# EasyEDA Pro project ProPrj_New Project_2026-07-15_23-14-34_2026-07-27.epro, schematic Schematic3
Board Name: Board1; Create Date: 2026-07-15; Page Name: P1; Project Name: New Project_2026-07-15_23-14-34; Schematic Name: Schematic1; Update Date: 2026-07-15; Company: EasyEDA.com; Page Size: A4; Version: V1.0
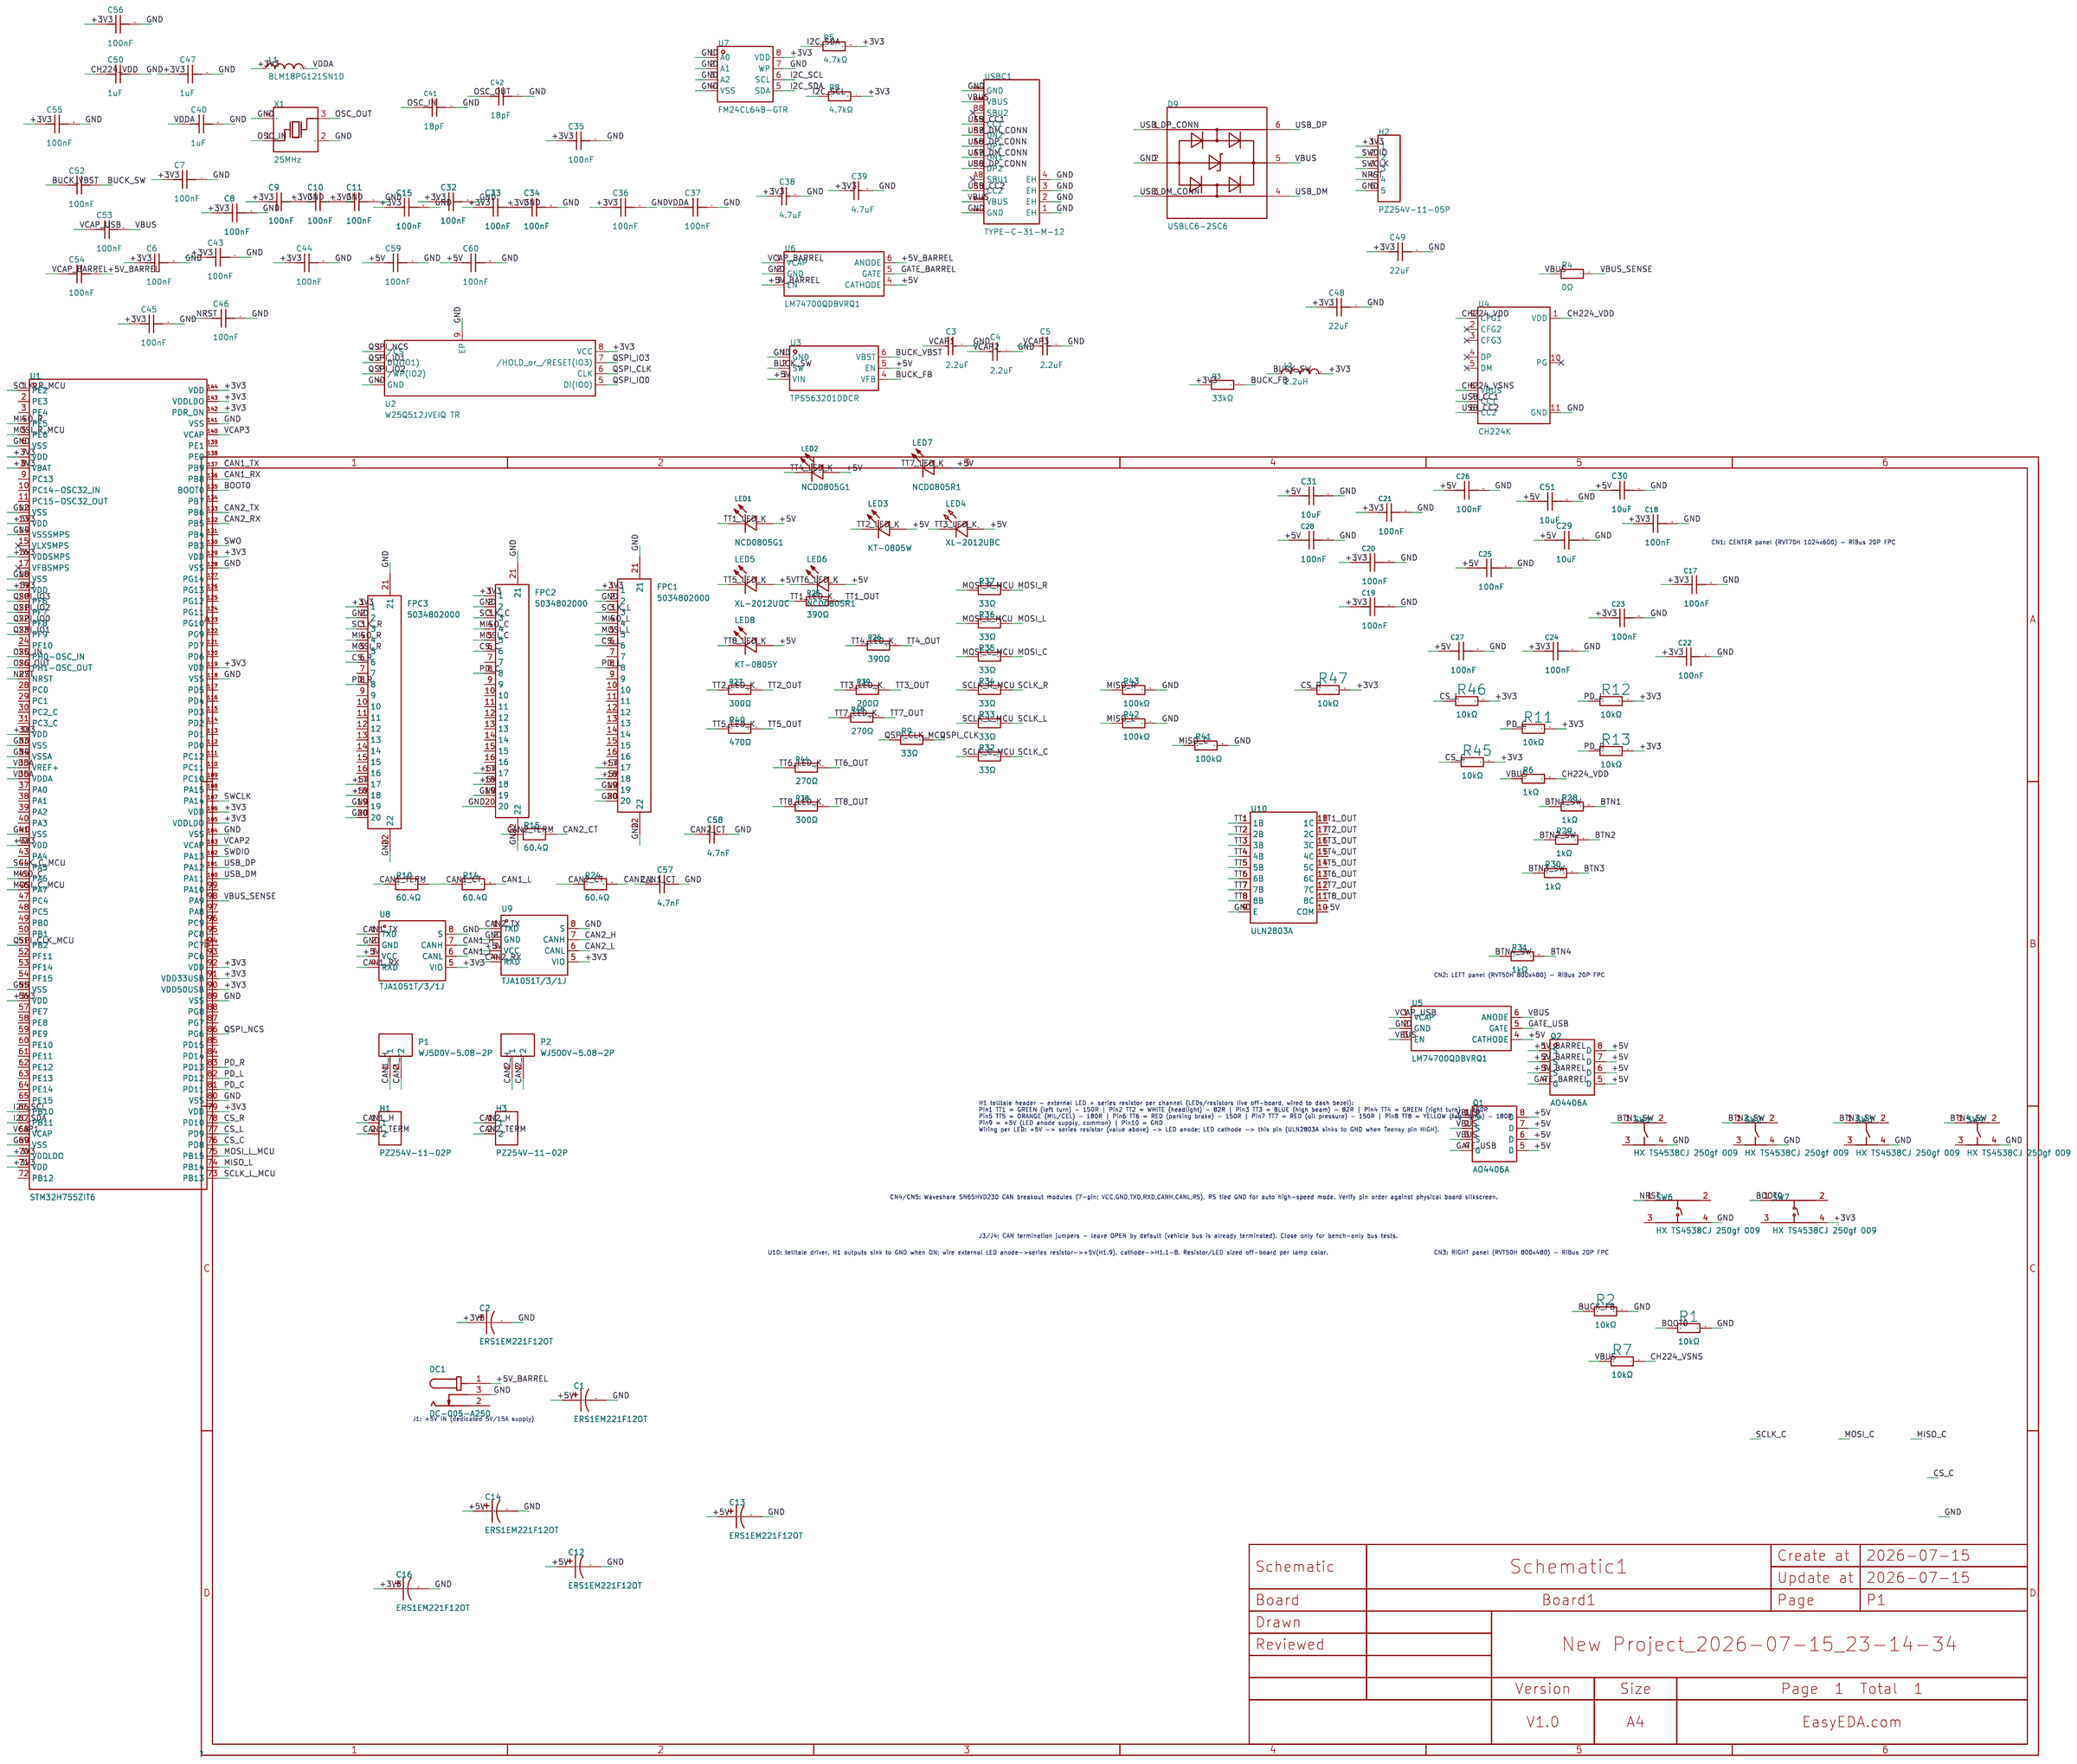
[diagram p0: schematic sheet]

## Parts
C1  220µF 25V  [CAP-TH_BD8.0-P3.50-D0.6-FD]
C2  220µF 25V  [CAP-TH_BD8.0-P3.50-D0.6-FD]
C3  2.2uF  [C0603]
C4  2.2uF  [C0603]
C5  2.2uF  [C0603]
C6  100nF  [C0603]
C7  100nF  [C0603]
C8  100nF  [C0603]
C9  100nF  [C0603]
C10  100nF  [C0603]
C11  100nF  [C0603]
C12  220µF 25V  [CAP-TH_BD8.0-P3.50-D0.6-FD]
C13  220µF 25V  [CAP-TH_BD8.0-P3.50-D0.6-FD]
C14  220µF 25V  [CAP-TH_BD8.0-P3.50-D0.6-FD]
C15  100nF  [C0603]
C16  220µF 25V  [CAP-TH_BD8.0-P3.50-D0.6-FD]
C17  100nF  [C0603]
C18  100nF  [C0603]
C19  100nF  [C0603]
C20  100nF  [C0603]
C21  100nF  [C0603]
C22  100nF  [C0603]
C23  100nF  [C0603]
C24  100nF  [C0603]
C25  100nF  [C0603]
C26  100nF  [C0603]
C27  100nF  [C0603]
C28  100nF  [C0603]
C29  10uF  [C0805]
C30  10uF  [C0805]
C31  10uF  [C0805]
C32  100nF  [C0603]
C33  100nF  [C0603]
C34  100nF  [C0603]
C35  100nF  [C0603]
C36  100nF  [C0603]
C37  100nF  [C0603]
C38  4.7uF  [C0805]
C39  4.7uF  [C0805]
C40  1uF  [C0603]
C41  18pF  [C0603]
C42  18pF  [C0603]
C43  100nF  [C0603]
C44  100nF  [C0603]
C45  100nF  [C0603]
C46  100nF  [C0603]
C47  1uF  [C0603]
C48  22uF  [C0805]
C49  22uF  [C0805]
C50  1uF  [C0603]
C51  10uF  [C0805]
C52  100nF  [C0603]
C53  100nF  [C0603]
C54  100nF  [C0603]
C55  100nF  [C0603]
C56  100nF  [C0603]
C57  4.7nF  [C0603]
C58  4.7nF  [C0603]
C59  100nF  [C0603]
C60  100nF  [C0603]
D9  USBLC6-2SC6  [SOT-23-6_L2.9-W1.6-P0.95-LS2.8-BL]
DC1  DC-005 5.5x2.5 5A  [DC-IN-TH_DC-005-2]
FPC1  RiBus LEFT panel  [FPC-SMD_5034802000]
FPC2  RiBus CENTER panel  [FPC-SMD_5034802000]
FPC3  RiBus RIGHT panel  [FPC-SMD_5034802000]
H1  PZ254V-11-02P  [HDR-TH_2P-P2.54-V-M]
H2  PZ254V-11-05P  [HDR-TH_5P-P2.54-V-M]
H3  PZ254V-11-02P  [HDR-TH_2P-P2.54-V-M]
L1  BLM18PG121SN1D  [L0603]
L2  2.2uH  [IND-SMD_L4.0-W4.0_FNR40XXS]
LED1  NCD0805G1  [LED0805-R-RD]
LED2  NCD0805G1  [LED0805-R-RD]
LED3  KT-0805W  [LED0805-R-RD]
LED4  XL-2012UBC  [LED0805-RD]
LED5  XL-2012UOC  [LED0805-RD_ORANGE]
LED6  NCD0805R1  [LED0805-RD]
LED7  NCD0805R1  [LED0805-RD]
LED8  KT-0805Y  [LED0805-R-RD]
P1  WJ500V-5.08-2P  [CONN-TH_2P-P5.00_WJ500V-5.08-2P]
P2  WJ500V-5.08-2P  [CONN-TH_2P-P5.00_WJ500V-5.08-2P]
Q1  AO4406A  [SOP-8_L5.0-W3.8-P1.27-LS6.0-BL]
Q2  AO4406A  [SOP-8_L5.0-W3.8-P1.27-LS6.0-BL]
R1  10kΩ  [R0603]
R2  10kΩ  [R0603]
R3  33kΩ  [R0603]
R4  0Ω  [R0603]
R5  4.7kΩ  [R0603]
R6  1kΩ  [R0603]
R7  10kΩ  [R0603]
R8  4.7kΩ  [R0603]
R9  33Ω  [R0603]
R10  60.4Ω  [R0603]
R11  10kΩ  [R0603]
R12  10kΩ  [R0603]
R13  10kΩ  [R0603]
R14  60.4Ω  [R0603]
R15  60.4Ω  [R0603]
R24  60.4Ω  [R0603]
R25  390Ω  [R0603]
R26  390Ω  [R0603]
R27  300Ω  [R0603]
R28  1kΩ  [R0603]
R29  1kΩ  [R0603]
R30  1kΩ  [R0603]
R31  1kΩ  [R0603]
R32  33Ω  [R0603]
R33  33Ω  [R0603]
R34  33Ω  [R0603]
R35  33Ω  [R0603]
R36  33Ω  [R0603]
R37  33Ω  [R0603]
R38  300Ω  [R0603]
R39  200Ω  [R0603]
R40  470Ω  [R0603]
R41  100kΩ  [R0603]
R42  100kΩ  [R0603]
R43  100kΩ  [R0603]
R44  270Ω  [R0603]
R45  10kΩ  [R0603]
R46  10kΩ  [R0603]
R47  10kΩ  [R0603]
R48  270Ω  [R0603]
SW1  tact 4.5x4.5 THT  [SW-TH_4P-L4.5-W4.5-P3.00-LS5.4]
SW2  tact 4.5x4.5 THT  [SW-TH_4P-L4.5-W4.5-P3.00-LS5.4]
SW3  tact 4.5x4.5 THT  [SW-TH_4P-L4.5-W4.5-P3.00-LS5.4]
SW4  tact 4.5x4.5 THT  [SW-TH_4P-L4.5-W4.5-P3.00-LS5.4]
SW6  HX TS4538CJ 250gf 009  [SW-TH_4P-L4.5-W4.5-P3.00-LS5.0]
SW7  HX TS4538CJ 250gf 009  [SW-TH_4P-L4.5-W4.5-P3.00-LS5.0]
U1  STM32H755ZIT6  [LQFP-144_L20.0-W20.0-P0.50-LS22.0-BL]
U2  W25Q512JVEIQ TR  [WSON-8_L8.0-W6.0-P1.27-TL-EP]
U3  TPS563201DDCR  [SOT-23-6_L2.9-W1.6-P0.95-LS2.8-BR]
U4  CH224K  [ESSOP-10_L4.9-W3.9-P1.0-LS6.0-TL-EP]
U5  LM74700QDBVRQ1  [SOT-23-6_L2.9-W1.6-P0.95-LS2.8-BL]
U6  LM74700QDBVRQ1  [SOT-23-6_L2.9-W1.6-P0.95-LS2.8-BL]
U7  FM24CL64B-GTR  [SOIC-8_L4.9-W3.9-P1.27-LS6.0-BL]
U8  TJA1051T/3/1J  [SOIC-8_L4.9-W3.9-P1.27-LS6.0-BL]
U9  TJA1051T/3/1J  [SOIC-8_L4.9-W3.9-P1.27-LS6.0-BL]
U10  ULN2803A  [SOIC-18_L11.6-W7.5-P1.27-LS10.3-BL]
USBC1  TYPE-C-31-M-12  [USB-C_SMD-TYPE-C-31-M-12_1]
X1  25MHz  [CRYSTAL-SMD_4P-L3.2-W2.5-BL]

## Library data of the parts
C1 C2 C12-C14 C16 = Capacitor_THT:CP_Radial_D8.0mm_P2.50mm: Supplier Part: C160162; Manufacturer: AISHI(Aihua Group); Manufacturer Part: ERS1EM221F12OT; Supplier Footprint: 470uF_25V; JLCPCB Part Class: Extended Part; Supplier: LCSC
C3-C5 = CL10A225KO8NNNC: Capacitance:2.2uF Tolerance:±10% Tolerance:±10% Voltage Rating:16V Temperature Coefficient:X5R; LCSC Part Name: 2.2uF ±10% 16V; Supplier Part: C23630; Manufacturer: SAMSUNG(三星); Supplier Footprint: 0603; JLCPCB Part Class: Basic Part; Datasheet: https://item.szlcsc.com/datasheet/CL10A225KO8NNNC/24366.html; Supplier: LCSC; Tolerance: ±10%; Voltage Rating: 16V; Temperature Coefficient: X5R
C6-C11 C15 C32-C37 C43-C46 C52-C56 C59 C60 = CC0603KRX7R9BB104: Capacitance:100nF Tolerance:±10% Tolerance:±10% Voltage Rating:50V Temperature Coefficient:X7R; LCSC Part Name: 100nF ±10% 50V; Supplier Part: C14663; Manufacturer: YAGEO(国巨); Supplier Footprint: 0603; JLCPCB Part Class: Basic Part; Datasheet: https://item.szlcsc.com/datasheet/CC0603KRX7R9BB104/15331.html; Supplier: LCSC; Tolerance: ±10%; Voltage Rating: 50V; Temperature Coefficient: X7R
C17-C28 = CL10B104KB8NNNC: Capacitance:100nF Tolerance:±10% Tolerance:±10% Voltage Rating:50V Temperature Coefficient:X7R; LCSC Part Name: 100nF ±10% 50V; Supplier Part: C1591; Manufacturer: SAMSUNG(三星); Supplier Footprint: 0603; JLCPCB Part Class: Extended Part; Datasheet: https://item.szlcsc.com/datasheet/CL10B104KB8NNNC/1943.html; Supplier: LCSC; Tolerance: ±10%; Voltage Rating: 50V; Temperature Coefficient: X7R
C29-C31 C51 = CL21A106KAYNNNE_C15850: Capacitance:10uF Tolerance:±10% Tolerance:±10% Voltage Rating:25V Temperature Coefficient:X5R; LCSC Part Name: 10uF ±10% 25V; Supplier Part: C15850; Manufacturer: SAMSUNG(三星); Manufacturer Part: CL21A106KAYNNNE; Supplier Footprint: 0805; JLCPCB Part Class: Basic Part; Datasheet: https://item.szlcsc.com/datasheet/CL21A106KAYNNNE/16532.html; Supplier: LCSC; Tolerance: ±10%; Voltage Rating: 25V; Temperature Coefficient: X5R
C38 C39 = CL21A475KAQNNNE: Capacitance:4.7uF Tolerance:±10% Tolerance:±10% Voltage Rating:25V Temperature Coefficient:X5R; LCSC Part Name: 4.7uF ±10% 25V; Supplier Part: C1779; Manufacturer: SAMSUNG(三星); Supplier Footprint: 0805; JLCPCB Part Class: Basic Part; Datasheet: https://item.szlcsc.com/datasheet/CL21A475KAQNNNE/2131.html; Supplier: LCSC; Tolerance: ±10%; Voltage Rating: 25V; Temperature Coefficient: X5R
C40 C47 C50 = CL10A105KB8NNNC: Capacitance:1uF Tolerance:±10% Tolerance:±10% Voltage Rating:50V Temperature Coefficient:X5R; LCSC Part Name: 1uF ±10% 50V; Supplier Part: C15849; Manufacturer: SAMSUNG(三星); Supplier Footprint: 0603; JLCPCB Part Class: Basic Part; Datasheet: https://item.szlcsc.com/datasheet/CL10A105KB8NNNC/16531.html; Supplier: LCSC; Tolerance: ±10%; Voltage Rating: 50V; Temperature Coefficient: X5R
C41 C42 = CC0603FRNPO9BN180: Capacitance:18pF Tolerance:±1% Tolerance:±1% Voltage Rating:50V Temperature Coefficient:NP0; LCSC Part Name: 18pF ±1% 50V; Supplier Part: C527046; Manufacturer: YAGEO(国巨); Supplier Footprint: 0603; JLCPCB Part Class: Extended Part; Datasheet: https://item.szlcsc.com/datasheet/CC0603FRNPO9BN180/545472.html; Supplier: LCSC; Tolerance: ±1%; Voltage Rating: 50V; Temperature Coefficient: NP0
C48 C49 = CL21A226MAQNNNE: Capacitance:22uF Tolerance:±20% Tolerance:±20% Voltage Rating:25V Temperature Coefficient:X5R; LCSC Part Name: 22uF ±20% 25V; Supplier Part: C45783; Manufacturer: SAMSUNG(三星); Supplier Footprint: 0805; JLCPCB Part Class: Basic Part; Datasheet: https://item.szlcsc.com/datasheet/CL21A226MAQNNNE/46786.html; Supplier: LCSC; Tolerance: ±20%; Voltage Rating: 25V; Temperature Coefficient: X5R
C57 C58 = 0603B472K500NT: Capacitance:4.7nF Tolerance:±10% Tolerance:±10% Voltage Rating:50V Temperature Coefficient:X7R; LCSC Part Name: 4.7nF ±10% 50V; Supplier Part: C53987; Manufacturer: FH(风华); Supplier Footprint: 0603; JLCPCB Part Class: Basic Part; Datasheet: https://item.szlcsc.com/datasheet/0603B472K500NT/55004.html; Supplier: LCSC; Tolerance: ±10%; Voltage Rating: 50V; Temperature Coefficient: X7R
D9 = USBLC6-2SC6_C7519: Polarity:Unidirectional Reverse Stand-Off Voltage (Vrwm):5.25V Clamping Voltage:17V Peak Pulse Current (Ipp):5A Voltage - Breakdown:6V Reverse Leakage Current (Ir):150nA Number of Channels:2 Operating Temperature:-40℃~+125℃ Operating Temperature:-40℃~+125; LCSC Part Name: 单向ESD; Supplier Part: C7519; Manufacturer: ST(意法半导体); Supplier Footprint: SOT-23-6L; JLCPCB Part Class: Extended Part; Datasheet: https://item.szlcsc.com/datasheet/USBLC6-2SC6/7996.html; Supplier: LCSC; Polarity: Unidirectional; Reverse Stand-Off Voltage (Vrwm): 5.25V; Clamping Voltage: 17V; Peak Pulse Current (Ipp): 5A; Voltage - Breakdown: 6V; Reverse Leakage Current (Ir): 150nA; Number of Channels: 2; Operating Temperature: -40℃~+125℃; level of protection: IEC 61000-4-2; Type: ESD; Junction Capacitance: 3.5pF
DC1 = DC-005-5.5*2.5: Supplier Part: C720558; Manufacturer: XUNPU; Manufacturer Part: DC-005-A250; Supplier Footprint: DC-005; JLCPCB Part Class: Extended Part; Supplier: LCSC
FPC1-FPC3 = 5034802000: Locking Feature:Hinged Lid Contact Type:Double-Sided Contacts, Top and Bottom Entry Number of Contacts:20P Pitch:0.5mm Mounting Type:Surface Mount, Right Angle FFC, FCB Thickness:0.3mm FFC, FCB Thickness:0.3mm Height Above Board:1mm Contact Material:Phosp; LCSC Part Name: 翻盖式 双侧触点/上下接 P数:20P 间距:0.5mm; Supplier Part: C234192; Manufacturer: MOLEX; Supplier Footprint: SMD,P=0.5mm,卧贴; JLCPCB Part Class: Extended Part; Datasheet: https://www.molex.com/content/dam/molex/molex-dot-com/products/automated/en-us/salesdrawingpdf/503/503480/5034802000_sd.pdf?inline; Supplier: LCSC; Locking Feature: Hinged Lid; Contact Type: Double-Sided Contacts, Top and Bottom Entry; Number of Contacts: 20P; Pitch: 0.5mm; Mounting Type: Surface Mount, Right Angle; FFC, FCB Thickness: 0.3mm; Height Above Board: 1mm; Contact Material: Phosphor bronze; Contact Plating: Gold; Operating Temperature: -40℃~+85℃; Rated Voltage (Max): 50V; Current Rating (Max): 500mA
H1 H3 = PZ254V-11-02P: Pin Structure:1x2P Pitch:2.54mm Row Spacing:- Circluar Pins/Square Pins:Pin Header Mounting Type:Through Hole Number of Rows:1 Number of Pins:2P Current Rating:3A Voltage Rating (Max):250V Length of Mating Pin:6mm Insulation Height:2.5mm Length of End Con; LCSC Part Name: 1x2P 间距:2.54mm 方针 直插; Supplier Part: C492401; Manufacturer: XFCN(兴飞); Supplier Footprint: 插件,P=2.54mm; JLCPCB Part Class: Extended Part; Datasheet: https://item.szlcsc.com/datasheet/PZ254V-11-02P/502957.html; Supplier: LCSC; Pin Structure: 1x2P; Pitch: 2.54mm; Circluar Pins/Square Pins: Pin Header; Mounting Type: Through Hole; Number of Rows: 1; Number of Pins: 2P; Current Rating: 3A; Voltage Rating (Max): 250V; Length of Mating Pin: 6mm; Insulation Height: 2.5mm; Length of End Connection Pin: 3mm; Contact Material: Brass; Operating Temperature: -40℃~+105℃; Color: Black
H2 = PZ254V-11-05P: Pin Structure:1x5P Pitch:2.54mm Row Spacing:- Circluar Pins/Square Pins:Pin Header Mounting Type:Through Hole Number of Rows:1 Number of Pins:5P Current Rating:3A Voltage Rating (Max):250V Length of Mating Pin:6mm Insulation Height:2.5mm Length of End Con; LCSC Part Name: 1x5P 间距:2.54mm 方针 直插; Supplier Part: C492404; Manufacturer: XFCN(兴飞); Supplier Footprint: 插件,P=2.54mm; JLCPCB Part Class: Extended Part; Datasheet: https://item.szlcsc.com/datasheet/PZ254V-11-05P/502960.html; Supplier: LCSC; Pin Structure: 1x5P; Pitch: 2.54mm; Circluar Pins/Square Pins: Pin Header; Mounting Type: Through Hole; Number of Rows: 1; Number of Pins: 5P; Current Rating: 3A; Voltage Rating (Max): 250V; Length of Mating Pin: 6mm; Insulation Height: 2.5mm; Length of End Connection Pin: 3mm; Contact Material: Brass; Operating Temperature: -40℃~+105℃; Color: Black
L1 = BLM18PG121SN1D_C14709: Impedance @ Frequency:120Ω@100MHz Tolerance:±25% Tolerance:±25% DC Resistance(DCR):50mΩ Current Rating:2A Number of Circuits:1 Operating Temperature:-55℃~+125℃ Operating Temperature:-55℃~+125℃; LCSC Part Name: 单路 0603磁珠 阻抗120Ω@100MHz; Supplier Part: C14709; Manufacturer: muRata(村田); Supplier Footprint: 0603; JLCPCB Part Class: Basic Part; Datasheet: https://item.szlcsc.com/datasheet/BLM18PG121SN1D/15379.html; Supplier: LCSC; Impedance @ Frequency: 120Ω@100MHz; Tolerance: ±25%; DC Resistance(DCR): 50mΩ; Current Rating: 2A; Number of Circuits: 1; Operating Temperature: -55℃~+125℃
L2 = FNR4030S2R2MT: Inductance:2.2uH Tolerance:±20% Tolerance:±20% Current Rating:3.2A Current - Saturation(Isat):5.8A DC Resistance(DCR):39mΩ Type:Magnetic Shielded Inductor; LCSC Part Name: 2.2uH ±20% 5.8A; Supplier Part: C167869; Manufacturer: cjiang(长江微电); Supplier Footprint: SMD,4x4mm; JLCPCB Part Class: Extended Part; Datasheet: https://item.szlcsc.com/datasheet/FNR4030S2R2MT/179252.html; Supplier: LCSC; Tolerance: ±20%; Current Rating: 3.2A; Current - Saturation(Isat): 5.8A; DC Resistance(DCR): 39mΩ; Type: Magnetic Shielded Inductor
LED1 LED2 = NCD0805G1: Lamp Holder Type:- Illumination Color:Green Voltage - Forward(Vf):2.5V~3.6V Voltage - Forward(Vf):2.5V~3.6V Power(Watts):72mW Forward Current:20mA Wavelength - Dominant:525nm~537.5nm Wavelength - Dominant:525nm~537.5nm Peak Wavelength:520nm Peak Wavelengt; LCSC Part Name: 片式发光二极管; Supplier Part: C84260; Manufacturer: 国星光电; Supplier Footprint: 0805; JLCPCB Part Class: Extended Part; Datasheet: https://item.szlcsc.com/datasheet/NCD0805G1/85429.html; Supplier: LCSC; Illumination Color: Green; Voltage - Forward(Vf): 2.5V~3.6V; Power(Watts): 72mW; Forward Current: 20mA; Wavelength - Dominant: 525nm~537.5nm; Peak Wavelength: 520nm; Diode Configuration: Discrete Diode; Luminous Intensity: 400mcd; Viewing Angle: 130°; Operating Temperature: -30℃~+85℃
LED3 = KT-0805W: Lamp Holder Type:2mm x 1.25mm square LED Illumination Color:White Voltage - Forward(Vf):2.6V~3.2V Voltage - Forward(Vf):2.6V~3.2V Power(Watts):80mW Forward Current:25mA Wavelength - Dominant:- Wavelength - Dominant:- Peak Wavelength:- Peak Wavelength:- Di; LCSC Part Name: 0805 白灯 高亮; Supplier Part: C34499; Manufacturer: KENTO; Supplier Footprint: 0805; JLCPCB Part Class: Basic Part; Datasheet: https://item.szlcsc.com/datasheet/KT-0805W/35468.html; Supplier: LCSC; Lamp Holder Type: 2mm x 1.25mm square LED; Illumination Color: White; Voltage - Forward(Vf): 2.6V~3.2V; Power(Watts): 80mW; Forward Current: 25mA; Diode Configuration: Discrete Diode; Lens Color: Yellow Lens; Color Temperature: 13172K~100000K; Luminous Intensity: 350mcd; Viewing Angle: 120°; Mounting Style: Top-mount; Operating Temperature: -30℃~+85℃
LED4 = XL-2012UBC: Lamp Holder Type:2.0mm x 1.2mm square LED Illumination Color:Blue Voltage - Forward(Vf):3.2V Voltage - Forward(Vf):3.2V Power(Watts):70mW Forward Current:20mA Wavelength - Dominant:460nm~475nm Wavelength - Dominant:460nm~475nm Peak Wavelength:470nm Peak W; LCSC Part Name: 0805蓝贴片式发光二极管; Supplier Part: C965817; Manufacturer: XINGLIGHT(成兴光); Supplier Footprint: 0805; JLCPCB Part Class: Extended Part; Datasheet: https://item.szlcsc.com/datasheet/XL-2012UBC/1051426.html; Supplier: LCSC; Lamp Holder Type: 2.0mm x 1.2mm square LED; Illumination Color: Blue; Voltage - Forward(Vf): 3.2V; Power(Watts): 70mW; Forward Current: 20mA; Wavelength - Dominant: 460nm~475nm; Peak Wavelength: 470nm; Diode Configuration: Discrete Diode; Lens Color: Water Clear; Luminous Intensity: 260mcd; Viewing Angle: 120°; Mounting Style: Top-mount; Operating Temperature: -40℃~+85℃
LED5 = XL-2012UOC: Lamp Holder Type:- Illumination Color:Orange Voltage - Forward(Vf):2.3V Voltage - Forward(Vf):2.3V Power(Watts):50mW Forward Current:20mA Wavelength - Dominant:600nm~610nm Wavelength - Dominant:600nm~610nm Peak Wavelength:605nm Peak Wavelength:605nm Diode; LCSC Part Name: 0805橙贴片式发光二极管; Supplier Part: C965813; Manufacturer: XINGLIGHT(成兴光); Supplier Footprint: 0805; JLCPCB Part Class: Extended Part; Datasheet: https://item.szlcsc.com/datasheet/XL-2012UOC/1051422.html; Supplier: LCSC; Illumination Color: Orange; Voltage - Forward(Vf): 2.3V; Power(Watts): 50mW; Forward Current: 20mA; Wavelength - Dominant: 600nm~610nm; Peak Wavelength: 605nm; Diode Configuration: Discrete Diode; Lens Color: Water Clear; Luminous Intensity: 330mcd; Viewing Angle: 120°; Mounting Style: Top-mount; Operating Temperature: -40℃~+85℃
LED6 LED7 = NCD0805R1_C84256: Lamp Holder Type:- Illumination Color:Red Voltage - Forward(Vf):1.6V~2.6V Voltage - Forward(Vf):1.6V~2.6V Power(Watts):65mW Forward Current:25mA Wavelength - Dominant:615nm~630nm Wavelength - Dominant:615nm~630nm Peak Wavelength:630nm Peak Wavelength:630n; LCSC Part Name: 片式发光二极管; Supplier Part: C84256; Manufacturer: 国星光电; Supplier Footprint: 0805; JLCPCB Part Class: Basic Part; Datasheet: https://item.szlcsc.com/datasheet/NCD0805R1/85425.html; Supplier: LCSC; Illumination Color: Red; Voltage - Forward(Vf): 1.6V~2.6V; Power(Watts): 65mW; Forward Current: 25mA; Wavelength - Dominant: 615nm~630nm; Peak Wavelength: 630nm; Diode Configuration: Discrete Diode; Luminous Intensity: 195mcd; Viewing Angle: 130°; Operating Temperature: -30℃~+85℃
LED8 = KT-0805Y: Lamp Holder Type:- Illumination Color:Yellow Voltage - Forward(Vf):1.8V~2.4V Voltage - Forward(Vf):1.8V~2.4V Power(Watts):40mW Forward Current:- Wavelength - Dominant:584nm~594nm Wavelength - Dominant:584nm~594nm Peak Wavelength:596nm Peak Wavelength:596n; LCSC Part Name: 0805 黄灯 高亮; Supplier Part: C2296; Manufacturer: KENTO; Supplier Footprint: 0805; JLCPCB Part Class: Basic Part; Datasheet: https://item.szlcsc.com/datasheet/KT-0805Y/2669.html; Supplier: LCSC; Illumination Color: Yellow; Voltage - Forward(Vf): 1.8V~2.4V; Power(Watts): 40mW; Wavelength - Dominant: 584nm~594nm; Peak Wavelength: 596nm; Diode Configuration: Discrete Diode; Lens Color: Water Clear; Luminous Intensity: 175mcd; Viewing Angle: 120°; Operating Temperature: -40℃~+85℃
P1 P2 = WJ500V-5.08-2P: Number of Positions or Pins:1x2P Pitch:5.08mm Color:Green Mounting Type:Through Hole Number of Pins:2P Number of Rows:1 Number of PINs Per Row:2 Screw Specification:M2.5 Current Rating:18A Voltage Rating (Max):250V Wire Gauge - AWG:14~30 Wire Gauge - mm2:; LCSC Part Name: 1x2P 5.08mm 直插 排数:1 每排P数:2; Supplier Part: C8465; Manufacturer: KANGNEX(康奈克斯电气); Supplier Footprint: 插件,P=5.08mm; JLCPCB Part Class: Extended Part; Datasheet: https://item.szlcsc.com/datasheet/WJ500V-5.08-2P/8959.html; Supplier: LCSC; Number of Positions or Pins: 1x2P; Pitch: 5.08mm; Color: Green; Mounting Type: Through Hole; Number of Pins: 2P; Number of Rows: 1; Number of PINs Per Row: 2; Screw Specification: M2.5; Current Rating: 18A; Voltage Rating (Max): 250V; Wire Gauge - AWG: 14~30; Wire Gauge - mm2: 2.5; Operating Temperature: -40℃~+105℃
Q1 Q2 = AO4406A: Number:1 N-Channel Drain to Source Voltage:30V Current - Continuous Drain(Id):12A RDS(on):10mΩ@10V Pd - Power Dissipation:4.5W Gate Threshold Voltage (Vgs(th)):1.5V@250uA Gate Charge(Qg):12.6nC@4.5V Input Capacitance(Ciss):960pF Reverse Transfer Capacitan; LCSC Part Name: 1个N沟道 耐压:30V 电流:12A; Supplier Part: C2944312; Manufacturer: UMW(友台半导体); Supplier Footprint: SOP-8; JLCPCB Part Class: Extended Part; Datasheet: https://item.szlcsc.com/datasheet/AO4406A/3330327.html; Supplier: LCSC; Number: 1 N-Channel; Drain to Source Voltage: 30V; Current - Continuous Drain(Id): 12A; RDS(on): 10mΩ@10V; Pd - Power Dissipation: 4.5W; Gate Threshold Voltage (Vgs(th)): 1.5V@250uA; Gate Charge(Qg): 12.6nC@4.5V; Input Capacitance(Ciss): 960pF; Reverse Transfer Capacitance (Crss@Vds): 87pF; Operating Temperature: -55℃~+150℃; Type: N-Channel; Output Capacitance(Coss): 139pF
R1 R2 R7 = 0603WAF1002T5E: Type:Thick Film Resistor Resistance:10kΩ Tolerance:±1% Tolerance:±1% Power(Watts):100mW Voltage-Supply(Max):75V Temperature Coefficient:±100ppm/℃ Temperature Coefficient:±100ppm/℃ Operating Temperature:-55℃~+155℃ Operating Temperature:-55℃~+155℃; LCSC Part Name: 厚膜电阻 10kΩ ±1% 100mW; Supplier Part: C25804; Manufacturer: UNI-ROYAL(厚声); Supplier Footprint: 0603; JLCPCB Part Class: Basic Part; Datasheet: https://item.szlcsc.com/datasheet/0603WAF1002T5E/26547.html; Supplier: LCSC; Type: Thick Film Resistor; Tolerance: ±1%; Power(Watts): 100mW; Voltage-Supply(Max): 75V; Temperature Coefficient: ±100ppm/℃; Operating Temperature: -55℃~+155℃
R3 = 0603WAF3302T5E: Type:Thick Film Resistor Resistance:33kΩ Tolerance:±1% Tolerance:±1% Power(Watts):100mW Voltage-Supply(Max):75V Temperature Coefficient:±100ppm/℃ Temperature Coefficient:±100ppm/℃ Operating Temperature:-55℃~+155℃ Operating Temperature:-55℃~+155℃; LCSC Part Name: 33kΩ ±1% 100mW 厚膜电阻; Supplier Part: C4216; Manufacturer: UNI-ROYAL(厚声); Supplier Footprint: 0603; JLCPCB Part Class: Basic Part; Datasheet: https://item.szlcsc.com/datasheet/0603WAF3302T5E/4623.html; Supplier: LCSC; Type: Thick Film Resistor; Tolerance: ±1%; Power(Watts): 100mW; Voltage-Supply(Max): 75V; Temperature Coefficient: ±100ppm/℃; Operating Temperature: -55℃~+155℃
R4 = 0603WAF0000T5E: Type:Thick Film Resistor Resistance:0Ω Tolerance:±1% Tolerance:±1% Power(Watts):100mW Voltage-Supply(Max):75V Temperature Coefficient:- Temperature Coefficient:- Operating Temperature:-55℃~+155℃ Operating Temperature:-55℃~+155℃; LCSC Part Name: 0Ω ±1% 100mW 厚膜电阻; Supplier Part: C21189; Manufacturer: UNI-ROYAL(厚声); Supplier Footprint: 0603; JLCPCB Part Class: Basic Part; Datasheet: https://item.szlcsc.com/datasheet/0603WAF0000T5E/21903.html; Supplier: LCSC; Type: Thick Film Resistor; Tolerance: ±1%; Power(Watts): 100mW; Voltage-Supply(Max): 75V; Operating Temperature: -55℃~+155℃
R5 R8 = 0603WAF4701T5E: Type:Thick Film Resistor Resistance:4.7kΩ Tolerance:±1% Tolerance:±1% Power(Watts):100mW Voltage-Supply(Max):75V Temperature Coefficient:±100ppm/℃ Temperature Coefficient:±100ppm/℃ Operating Temperature:-55℃~+155℃ Operating Temperature:-55℃~+155℃; LCSC Part Name: 4.7kΩ ±1% 100mW 厚膜电阻; Supplier Part: C23162; Manufacturer: UNI-ROYAL(厚声); Supplier Footprint: 0603; JLCPCB Part Class: Basic Part; Datasheet: https://item.szlcsc.com/datasheet/0603WAF4701T5E/23889.html; Supplier: LCSC; Type: Thick Film Resistor; Tolerance: ±1%; Power(Watts): 100mW; Voltage-Supply(Max): 75V; Temperature Coefficient: ±100ppm/℃; Operating Temperature: -55℃~+155℃
R6 R28-R31 = 0603WAF1001T5E: Type:Thick Film Resistor Resistance:1kΩ Tolerance:±1% Tolerance:±1% Power(Watts):100mW Voltage-Supply(Max):75V Temperature Coefficient:±100ppm/℃ Temperature Coefficient:±100ppm/℃ Operating Temperature:-55℃~+155℃ Operating Temperature:-55℃~+155℃; LCSC Part Name: 1kΩ ±1% 100mW 厚膜电阻; Supplier Part: C21190; Manufacturer: UNI-ROYAL(厚声); Supplier Footprint: 0603; JLCPCB Part Class: Basic Part; Datasheet: https://item.szlcsc.com/datasheet/0603WAF1001T5E/21904.html; Supplier: LCSC; Type: Thick Film Resistor; Tolerance: ±1%; Power(Watts): 100mW; Voltage-Supply(Max): 75V; Temperature Coefficient: ±100ppm/℃; Operating Temperature: -55℃~+155℃
R9 R32-R37 = 0603WAF330JT5E: Type:Thick Film Resistor Resistance:33Ω Tolerance:±1% Tolerance:±1% Power(Watts):100mW Voltage-Supply(Max):75V Temperature Coefficient:±100ppm/℃ Temperature Coefficient:±100ppm/℃ Operating Temperature:-55℃~+155℃ Operating Temperature:-55℃~+155℃; LCSC Part Name: 33Ω ±1% 100mW 厚膜电阻; Supplier Part: C23140; Manufacturer: UNI-ROYAL(厚声); Supplier Footprint: 0603; JLCPCB Part Class: Basic Part; Datasheet: https://item.szlcsc.com/datasheet/0603WAF330JT5E/23867.html; Supplier: LCSC; Type: Thick Film Resistor; Tolerance: ±1%; Power(Watts): 100mW; Voltage-Supply(Max): 75V; Temperature Coefficient: ±100ppm/℃; Operating Temperature: -55℃~+155℃
R10 R14 R15 R24 = FRC0603F60R4TS: Type:Thick Film Resistor Resistance:60.4Ω Tolerance:±1% Tolerance:±1% Power(Watts):100mW Voltage-Supply(Max):75V Temperature Coefficient:±100ppm/℃ Temperature Coefficient:±100ppm/℃ Operating Temperature:-55℃~+155℃ Operating Temperature:-55℃~+155℃; LCSC Part Name: 60.4Ω ±1% 100mW 厚膜电阻; Supplier Part: C2933247; Manufacturer: FOJAN(富捷); Supplier Footprint: 0603; JLCPCB Part Class: Extended Part; Datasheet: https://item.szlcsc.com/datasheet/FRC0603F60R4TS/3279349.html; Supplier: LCSC; Type: Thick Film Resistor; Tolerance: ±1%; Power(Watts): 100mW; Voltage-Supply(Max): 75V; Temperature Coefficient: ±100ppm/℃; Operating Temperature: -55℃~+155℃
R11-R13 R45-R47 = 0603WAF1002T5E: Type:Thick Film Resistor Resistance:10kΩ Tolerance:±1% Tolerance:±1% Power(Watts):100mW Voltage-Supply(Max):75V Temperature Coefficient:±100ppm/℃ Temperature Coefficient:±100ppm/℃ Operating Temperature:-55℃~+155℃ Operating Temperature:-55℃~+155℃; LCSC Part Name: 厚膜电阻 10kΩ ±1% 100mW; Supplier Part: C98220; Manufacturer: YAGEO; Manufacturer Part: RC0603FR-0710KL; Supplier Footprint: 0603; JLCPCB Part Class: Basic Part; Datasheet: https://item.szlcsc.com/datasheet/0603WAF1002T5E/26547.html; Supplier: LCSC; Type: Thick Film Resistor; Tolerance: ±1%; Power(Watts): 100mW; Voltage-Supply(Max): 75V; Temperature Coefficient: ±100ppm/℃; Operating Temperature: -55℃~+155℃
R25 R26 = 0603WAF3900T5E: Type:Thick Film Resistor Resistance:390Ω Tolerance:±1% Tolerance:±1% Power(Watts):100mW Voltage-Supply(Max):75V Temperature Coefficient:±100ppm/℃ Temperature Coefficient:±100ppm/℃ Operating Temperature:-55℃~+155℃ Operating Temperature:-55℃~+155℃; LCSC Part Name: 390Ω ±1% 100mW 厚膜电阻; Supplier Part: C23151; Manufacturer: UNI-ROYAL(厚声); Supplier Footprint: 0603; JLCPCB Part Class: Basic Part; Datasheet: https://item.szlcsc.com/datasheet/0603WAF3900T5E/23878.html; Supplier: LCSC; Type: Thick Film Resistor; Tolerance: ±1%; Power(Watts): 100mW; Voltage-Supply(Max): 75V; Temperature Coefficient: ±100ppm/℃; Operating Temperature: -55℃~+155℃
R27 R38 = 0603WAF3000T5E: Type:Thick Film Resistor Resistance:300Ω Tolerance:±1% Tolerance:±1% Power(Watts):100mW Voltage-Supply(Max):75V Temperature Coefficient:±100ppm/℃ Temperature Coefficient:±100ppm/℃ Operating Temperature:-55℃~+155℃ Operating Temperature:-55℃~+155℃; LCSC Part Name: 300Ω ±1% 100mW 厚膜电阻; Supplier Part: C23025; Manufacturer: UNI-ROYAL(厚声); Supplier Footprint: 0603; JLCPCB Part Class: Basic Part; Datasheet: https://item.szlcsc.com/datasheet/0603WAF3000T5E/23752.html; Supplier: LCSC; Type: Thick Film Resistor; Tolerance: ±1%; Power(Watts): 100mW; Voltage-Supply(Max): 75V; Temperature Coefficient: ±100ppm/℃; Operating Temperature: -55℃~+155℃
R39 = 0603WAF2000T5E: Type:Thick Film Resistor Resistance:200Ω Tolerance:±1% Tolerance:±1% Power(Watts):100mW Voltage-Supply(Max):75V Temperature Coefficient:±100ppm/℃ Temperature Coefficient:±100ppm/℃ Operating Temperature:-55℃~+155℃ Operating Temperature:-55℃~+155℃; LCSC Part Name: 200Ω ±1% 100mW 厚膜电阻; Supplier Part: C8218; Manufacturer: UNI-ROYAL(厚声); Supplier Footprint: 0603; JLCPCB Part Class: Basic Part; Datasheet: https://item.szlcsc.com/datasheet/0603WAF2000T5E/8708.html; Supplier: LCSC; Type: Thick Film Resistor; Tolerance: ±1%; Power(Watts): 100mW; Voltage-Supply(Max): 75V; Temperature Coefficient: ±100ppm/℃; Operating Temperature: -55℃~+155℃
R40 = 0603WAF4700T5E: Type:Thick Film Resistor Resistance:470Ω Tolerance:±1% Tolerance:±1% Power(Watts):100mW Voltage-Supply(Max):75V Temperature Coefficient:±100ppm/℃ Temperature Coefficient:±100ppm/℃ Operating Temperature:-55℃~+155℃ Operating Temperature:-55℃~+155℃; LCSC Part Name: 470Ω ±1% 100mW 厚膜电阻; Supplier Part: C23179; Manufacturer: UNI-ROYAL(厚声); Supplier Footprint: 0603; JLCPCB Part Class: Basic Part; Datasheet: https://item.szlcsc.com/datasheet/0603WAF4700T5E/23906.html; Supplier: LCSC; Type: Thick Film Resistor; Tolerance: ±1%; Power(Watts): 100mW; Voltage-Supply(Max): 75V; Temperature Coefficient: ±100ppm/℃; Operating Temperature: -55℃~+155℃
R41-R43 = 0603WAF1003T5E: Type:Thick Film Resistor Resistance:100kΩ Tolerance:±1% Tolerance:±1% Power(Watts):100mW Voltage-Supply(Max):75V Temperature Coefficient:±100ppm/℃ Temperature Coefficient:±100ppm/℃ Operating Temperature:-55℃~+155℃ Operating Temperature:-55℃~+155℃; LCSC Part Name: 100kΩ ±1% 100mW 厚膜电阻; Supplier Part: C25803; Manufacturer: UNI-ROYAL(厚声); Supplier Footprint: 0603; JLCPCB Part Class: Basic Part; Datasheet: https://item.szlcsc.com/datasheet/0603WAF1003T5E/26546.html; Supplier: LCSC; Type: Thick Film Resistor; Tolerance: ±1%; Power(Watts): 100mW; Voltage-Supply(Max): 75V; Temperature Coefficient: ±100ppm/℃; Operating Temperature: -55℃~+155℃
R44 R48 = 0603WAF2700T5E: Type:Thick Film Resistor Resistance:270Ω Tolerance:±1% Tolerance:±1% Power(Watts):100mW Voltage-Supply(Max):75V Temperature Coefficient:±100ppm/℃ Temperature Coefficient:±100ppm/℃ Operating Temperature:-55℃~+155℃ Operating Temperature:-55℃~+155℃; LCSC Part Name: 270Ω ±1% 100mW 厚膜电阻; Supplier Part: C22966; Manufacturer: UNI-ROYAL(厚声); Supplier Footprint: 0603; JLCPCB Part Class: Basic Part; Datasheet: https://item.szlcsc.com/datasheet/0603WAF2700T5E/23693.html; Supplier: LCSC; Type: Thick Film Resistor; Tolerance: ±1%; Power(Watts): 100mW; Voltage-Supply(Max): 75V; Temperature Coefficient: ±100ppm/℃; Operating Temperature: -55℃~+155℃
SW1-SW4 = 4.5x4.5x4.5Waterproof Tact Switch DIP 260g: LCSC Part Name: 4.5x4.5x4.5防水插件轻触开关260g; Supplier Part: C5340169; Manufacturer: hanxia; Manufacturer Part: HX TS4538CJ 250gf 009; Supplier Footprint: DIP-4P,4.5x4.5mm; Datasheet: https://atta.szlcsc.com/upload/public/pdf/source/20240809/87BC5FA876BA79D376E205D58434F11F.pdf; Supplier: LCSC
SW6 SW7 = HX TS4538CJ 250gf 009: Circuit:SPST Actuator Style:Round Button Operating Force:250gf Mounting Style:Direct Insert Switch Length:4.5mm Switch Width:4.5mm Switch Height:3.8mm Contact Current:50mA Voltage Rating:12V Actuator/Cap Color:Black With Lamp:None Mechanical Life:100,000; LCSC Part Name: 轻触开关插件 4.5*4.5*3.8mm按键开关 不锈钢弹片 250gf 四脚立式; Supplier Part: C5340169; Manufacturer: hanxia(韩下); Supplier Footprint: 插件; JLCPCB Part Class: Extended Part; Datasheet: https://atta.szlcsc.com/upload/public/pdf/source/20241121/3DC20841FC3B25ECF5750FEC9855FA3A.pdf; Supplier: LCSC; Circuit: SPST; Actuator Style: Round Button; Operating Force: 250gf; Mounting Style: Direct Insert; Switch Length: 4.5mm; Switch Width: 4.5mm; Switch Height: 3.8mm; Contact Current: 50mA; Voltage Rating: 12V; Actuator/Cap Color: Black; With Lamp: None; Mechanical Life: 100,000 Times; Operating Temperature: -25℃~+70℃
U1 = STM32H755ZIT6: CPU Core:ARM Cortex-M7；ARM Cortex-M4 CPU Maximum Speed:240MHz；480MHz Core Size:32 Bit Program Storage Size:2MB Program Memory Type:FLASH RAM Size:1MB EEPROM:- Number of I/O:97 ADC (Bit):16bit DAC (Bit):12bit Oscillator Type:Built-in Voltage - Supply:1.62V; LCSC Part Name: 带DSP和DP-FPU的高性能ARM Cortex-M7 + Cortex-M4 MCU，具有2 MB Flash、1 MB RAM、480 MHz CPU、ART加速器、一级缓存、外部存储器接口、包括加密加速器在内的大量外设、安全服务支持和SMPS; Supplier Part: C730212; Manufacturer: ST(意法半导体); Supplier Footprint: LQFP-144(20x20); JLCPCB Part Class: Extended Part; Datasheet: https://item.szlcsc.com/datasheet/STM32H755ZIT6/778167.html; Supplier: LCSC; CPU Core: ARM Cortex-M7；ARM Cortex-M4; CPU Maximum Speed: 240MHz；480MHz; Core Size: 32 Bit; Program Storage Size: 2MB; Program Memory Type: FLASH; RAM Size: 1MB; Number of I/O: 97; ADC (Bit): 16bit; DAC (Bit): 12bit; Oscillator Type: Built-in; Voltage - Supply: 1.62V~3.6V; Operating Temperature: -40℃~+85℃
U2 = W25Q512JVEIQ TR: Interface:SPI Memory Size:512Mbit Clock Frequency:133MHz Voltage - Supply:2.7V~3.6V Voltage - Supply:2.7V~3.6V Standby Supply Current:- Program / Erase Cycles:100,000 cycles Write Cycle Time (tWC):- Page Programming Time (Tpp):- Block Erase Time(tBE):- Da; LCSC Part Name: 支持双/四SPI接口的3V、512Mbit 串行闪存; Supplier Part: C7389628; Manufacturer: Winbond(华邦); Supplier Footprint: WSON-8(6x8); JLCPCB Part Class: Extended Part; Datasheet: https://item.szlcsc.com/datasheet/W25Q512JVEIQ%2520TR/8361477.html; Supplier: LCSC; Interface: SPI; Memory Size: 512Mbit; Clock Frequency: 133MHz; Voltage - Supply: 2.7V~3.6V; Program / Erase Cycles: 100,000 cycles; Data Retention - TDR (Year): 20 Years; Operating Temperature: -40℃~+85℃; Features: Hardware write protection；Absolute write protection；Write enable latch；Software write protection；Power-on reset；Power lock protection
U3 = TPS563201DDCR: Function:Step-down type Voltage - Supply:4.5V~17V Voltage - Supply:4.5V~17V Output Voltage:768mV~7V Output Voltage:768mV~7V Output Current:3A Frequency - Switching:580kHz Frequency - Switching:580kHz Operating Temperature:-40℃~+125℃@(TJ) Operating Tempera; LCSC Part Name: 降压型 3A 4.5V~17V; Supplier Part: C116592; Manufacturer: TI(德州仪器); Supplier Footprint: SOT-23-THIN-6; JLCPCB Part Class: Extended Part; Datasheet: https://item.szlcsc.com/datasheet/TPS563201DDCR/117846.html; Supplier: LCSC; Function: Step-down type; Voltage - Supply: 4.5V~17V; Output Voltage: 768mV~7V; Output Current: 3A; Frequency - Switching: 580kHz; Operating Temperature: -40℃~+125℃@(TJ); Synchronous Rectifier: Yes; Number of Outputs: 1; Topology: Buck; Quiescent Current: 380uA; Switch tube (built-in/external): Built-in; Output Type: Adjustable; Features: Light load efficient mode；Cycle-by-cycle current limiting；Overcurrent Protection；Hiccup current limiting
U4 = CH224K: Type:Power Receiver Controller Protocol:PD 3.0 Number of Channels:- Output Power:100W Output Voltage:5V；20V；15V；12V；9V Voltage - Supply:4V~30V Voltage - Supply:4V~30V Operating Temperature:-40℃~+90℃ Operating Temperature:-40℃~+90℃ Features:Thermal Protect; LCSC Part Name: USBPD等多快充协议受电芯片CH224; Supplier Part: C970725; Manufacturer: WCH(南京沁恒); Supplier Footprint: ESSOP-10-150mil-1mm; JLCPCB Part Class: Extended Part; Datasheet: https://item.szlcsc.com/datasheet/CH224K/1060460.html; Supplier: LCSC; Type: Power Receiver Controller; Protocol: PD 3.0; Output Power: 100W; Output Voltage: 5V；20V；15V；12V；9V; Voltage - Supply: 4V~30V; Operating Temperature: -40℃~+90℃; Features: Thermal Protection；Overvoltage protection
U5 U6 = LM74700QDBVRQ1_C2941042: LCSC Part Name: 低IQ电池反向保护理想二极管控制器; Supplier Part: C2941042; Manufacturer: TI(德州仪器); Supplier Footprint: SOT-23-6; JLCPCB Part Class: Extended Part; Datasheet: https://www.ti.com/cn/lit/gpn/lm74700-q1; Supplier: LCSC
U7 = FM24CL64B-GTR_C9829: Interface:I2C Memory Size:64Kbit Voltage - Supply:2.7V~3.65V Voltage - Supply:2.7V~3.65V Current - Supply:300uA Clock Frequency:1MHz Standby Current(Isb):3uA Sleep mode current (Izz):- Operating Temperature:-40℃~+85℃ Operating Temperature:-40℃~+85℃ Featur; Supplier Part: C9829; Manufacturer: Infineon/CYPRESS(赛普拉斯); Supplier Footprint: SOIC-8-150mil; JLCPCB Part Class: Extended Part; Datasheet: https://item.szlcsc.com/datasheet/FM24CL64B-GTR/10359.html; Supplier: LCSC; Interface: I2C; Memory Size: 64Kbit; Voltage - Supply: 2.7V~3.65V; Current - Supply: 300uA; Clock Frequency: 1MHz; Standby Current(Isb): 3uA; Operating Temperature: -40℃~+85℃
U8 U9 = TJA1051T/3/1J: Type: Data Rate:5Mbps Supply Voltage:4.5V~5.5V Supply Voltage:4.5V~5.5V Supply Current:5mA Operating Temperature:-40℃~+150℃ Operating Temperature:-40℃~+150℃; Supplier Part: C38695; Manufacturer: NXP(恩智浦); Supplier Footprint: SOIC-8-150mil; JLCPCB Part Class: Extended Part; Datasheet: https://www.nxp.com/docs/en/data-sheet/TJA1051.pdf; Supplier: LCSC; Data Rate: 5Mbps; Supply Voltage: 4.5V~5.5V; Supply Current: 5mA; Operating Temperature: -40℃~+150℃
U10 = ULN2803A_C181731: number of channels:8 Collector - Emitter Voltage VCEO:50V Current - Collector(Ic):500mA Voltage - Input(Max):30V Operating Temperature:-40℃~+85℃ Operating Temperature:-40℃~+85℃ Output Leakage Current(Icex):50uA Input Current(on):4mA Voltage - Forward(Vf):; LCSC Part Name: 八路高耐压大电流达林顿晶体管阵列; Supplier Part: C181731; Manufacturer: Mixic(中科芯亿达); Supplier Footprint: SOP-18-300mil; JLCPCB Part Class: Extended Part; Datasheet: https://item.szlcsc.com/datasheet/ULN2803A/193128.html; Supplier: LCSC; number of channels: 8; Collector - Emitter Voltage VCEO: 50V; Current - Collector(Ic): 500mA; Voltage - Input(Max): 30V; Operating Temperature: -40℃~+85℃; Output Leakage Current(Icex): 50uA; Input Current(on): 4mA; Voltage - Forward(Vf): 1.6V; Input Capacitiance(Ci): 15pF
USBC1 = TYPE-C-31-M-12: Connector Type:Type-C Protocol Standard:- Gender:Female Mounting Type:Surface Mount, Right Angle Number of Contacts:16P Number of Ports:1 Current Rating-Power:5A Voltage Rating:20V Connect-Disconnect Life:10,000 cycles Length:7.35mm Operating Temperature:; LCSC Part Name: Type-C 母 卧贴; Supplier Part: C165948; Manufacturer: 韩国韩荣; Supplier Footprint: SMD; JLCPCB Part Class: Extended Part; Datasheet: https://item.szlcsc.com/datasheet/TYPE-C-31-M-12/177331.html; Supplier: LCSC; Connector Type: Type-C; Gender: Female; Mounting Type: Surface Mount, Right Angle; Number of Contacts: 16P; Number of Ports: 1; Current Rating-Power: 5A; Voltage Rating: 20V; Connect-Disconnect Life: 10,000 cycles; Length: 7.35mm; Operating Temperature: -30℃~+80℃
X1 = X322525MOB4SI: Type:Crystal Oscillator Frequency:25MHz Normal temperature Frequency Tolerance:±10ppm Normal temperature Frequency Tolerance:±10ppm Load Capacitance:12pF Frequency Stability:±20ppm Frequency Stability:±20ppm Operating Temperature:-40℃~+85℃ Operating Tempe; LCSC Part Name: YSX321SL 25MHZ 4P 3225 12PF ±10PPM -40~85℃ (±20PPM); Supplier Part: C9006; Manufacturer: YXC(扬兴晶振); Supplier Footprint: SMD3225-4P; JLCPCB Part Class: Basic Part; Datasheet: https://item.szlcsc.com/datasheet/X322525MOB4SI/9526.html; Supplier: LCSC; Type: Crystal Oscillator; Normal temperature Frequency Tolerance: ±10ppm; Load Capacitance: 12pF; Frequency Stability: ±20ppm; Operating Temperature: -40℃~+85℃

## Nets
+3V3: C2.1 C6.1 C7.1 C8.1 C9.1 C10.1 C11.1 C15.1 C16.1 C17.1 C18.1 C19.1 C20.1 C21.1 C22.1 C23.1 C24.1 C32.1 C33.1 C34.1 C35.1 C36.1 C38.1 C39.1 C43.1 C44.1 C45.1 C47.1 C48.1 C49.1 C55.1 C56.1 FPC1.1 FPC2.1 FPC3.1 H2.1 L1.1 L2.2 R3.1 R5.2 R8.2 R11.2 R12.2 R13.2 R45.2 R46.2 R47.2 SW7.4(D) U1.7(VDD) U1.8(VBAT) U1.13(VDD) U1.16(VDDSMPS) U1.19(VDD) U1.32(VDD) U1.42(VDD) U1.56(VDD) U1.70(VDDLDO) U1.71(VDD) U1.79(VDD) U1.90(VDD50USB) U1.91(VDD33USB) U1.92(VDD) U1.105(VDDLDO) U1.106(VDD) U1.119(VDD) U1.129(VDD) U1.142(PDR_ON) U1.143(VDDLDO) U1.144(VDD) U2.8(VCC) U7.8(VDD) U8.5(VIO) U9.5(VIO)
+5V: C1.1 C12.1 C13.1 C14.1 C25.1 C26.1 C27.1 C28.1 C29.1 C30.1 C31.1 C51.1 C59.1 C60.1 FPC1.17 FPC1.18 FPC2.17 FPC2.18 FPC3.17 FPC3.18 LED1.1(A) LED2.1(A) LED3.1(A) LED4.2(A) LED5.2(+) LED6.2(+) LED7.2(+) LED8.1(+) Q1.5(D) Q1.6(D) Q1.7(D) Q1.8(D) Q2.5(D) Q2.6(D) Q2.7(D) Q2.8(D) U3.3(VIN) U3.5(EN) U5.4(CATHODE) U6.4(CATHODE) U8.3(VCC) U9.3(VCC) U10.10(COM)
+5V_BARREL: C54.2 DC1.1 Q2.1(S) Q2.2(S) Q2.3(S) U6.3(EN) U6.6(ANODE)
GND: C1.2 C2.2 C3.2 C4.2 C5.2 C6.2 C7.2 C8.2 C9.2 C10.2 C11.2 C12.2 C13.2 C14.2 C15.2 C16.2 C17.2 C18.2 C19.2 C20.2 C21.2 C22.2 C23.2 C24.2 C25.2 C26.2 C27.2 C28.2 C29.2 C30.2 C31.2 C32.2 C33.2 C34.2 C35.2 C36.2 C37.2 C38.2 C39.2 C40.2 C41.2 C42.2 C43.2 C44.2 C45.2 C46.2 C47.2 C48.2 C49.2 C50.2 C51.2 C55.2 C56.2 C57.2 C58.2 C59.2 C60.2 D9.2 DC1.3 FPC1.2 FPC1.19 FPC1.20 FPC1.21 FPC1.22 FPC2.2 FPC2.19 FPC2.20 FPC2.21 FPC2.22 FPC3.2 FPC3.19 FPC3.20 FPC3.21 FPC3.22 H2.5 R1.2 R2.2 R41.2 R42.2 R43.2 SW1.4 SW2.4 SW3.4 SW4.4 SW6.4(D) U1.6(VSS) U1.12(VSS) U1.14(VSSSMPS) U1.18(VSS) U1.33(VSS) U1.34(VSSA) U1.41(VSS) U1.55(VSS) U1.69(VSS) U1.80(VSS) U1.89(VSS) U1.104(VSS) U1.118(VSS) U1.128(VSS) U1.141(VSS) U2.4(GND) U2.9(EP) U3.1(GND) U4.11(GND) U5.2(GND) U6.2(GND) U7.1(A0) U7.2(A1) U7.3(A2) U7.4(VSS) U7.7(WP) U8.2(GND) U8.8(S) U9.2(GND) U9.8(S) U10.9(E) USBC1.1(EH) USBC1.2(EH) USBC1.3(EH) USBC1.4(EH) USBC1.A1B12(GND) USBC1.B1A12(GND) X1.2(GND) X1.4(GND)
VBUS: C53.2 D9.5 Q1.1(S) Q1.2(S) Q1.3(S) R4.1 R6.1 R7.1 U5.3(EN) U5.6(ANODE) USBC1.A4B9(VBUS) USBC1.B4A9(VBUS)
VBUS_SENSE: R4.2 U1.98(PA9)
VDDA: C37.1 C40.1 L1.2 U1.35(VREF+) U1.36(VDDA)
BOOT0: R1.1 SW7.1(A) U1.135(BOOT0)
BTN1: R28.2
BTN1_SW: R28.1 SW1.1
BTN2: R29.2
BTN2_SW: R29.1 SW2.1
BTN3: R30.2
BTN3_SW: R30.1 SW3.1
BTN4: R31.2
BTN4_SW: R31.1 SW4.1
BUCK_FB: R2.1 R3.2 U3.4(VFB)
BUCK_SW: C52.2 L2.1 U3.2(SW)
BUCK_VBST: C52.1 U3.6(VBST)
CAN1_CT: C57.1 R10.2 R14.1
CAN1_H: H1.1 P1.1 U8.7(CANH)
CAN1_L: P1.2 R14.2 U8.6(CANL)
CAN1_RX: U1.136(PB8) U8.4(RXD)
CAN1_TERM: H1.2 R10.1
CAN1_TX: U1.137(PB9) U8.1(TXD)
CAN2_CT: C58.1 R15.2 R24.1
CAN2_H: H3.1 P2.1 U9.7(CANH)
CAN2_L: P2.2 R24.2 U9.6(CANL)
CAN2_RX: U1.132(PB5) U9.4(RXD)
CAN2_TERM: H3.2 R15.1
CAN2_TX: U1.133(PB6) U9.1(TXD)
CH224_VDD: C50.1 R6.2 U4.1(VDD) U4.9(CFG1)
CH224_VSNS: R7.2 U4.8(VBUS)
CS_C: FPC2.6 R45.1 U1.76(PD8)
CS_L: FPC1.6 R46.1 U1.77(PD9)
CS_R: FPC3.6 R47.1 U1.78(PD10)
GATE_BARREL: Q2.4(G) U6.5(GATE)
GATE_USB: Q1.4(G) U5.5(GATE)
I2C_SCL: R8.1 U1.66(PB10) U7.6(SCL)
I2C_SDA: R5.1 U1.67(PB11) U7.5(SDA)
MISO_C: FPC2.4 R41.1 U1.45(PA6)
MISO_L: FPC1.4 R42.1 U1.74(PB14)
MISO_R: FPC3.4 R43.1 U1.4(PE5)
MOSI_C: FPC2.5 R35.2
MOSI_C_MCU: R35.1 U1.46(PA7)
MOSI_L: FPC1.5 R36.2
MOSI_L_MCU: R36.1 U1.75(PB15)
MOSI_R: FPC3.5 R37.2
MOSI_R_MCU: R37.1 U1.5(PE6)
NRST: C46.1 H2.4 SW6.1(A) U1.27(NRST)
OSC_IN: C41.1 U1.25(PH0-OSC_IN) X1.1(OSC1)
OSC_OUT: C42.1 U1.26(PH1-OSC_OUT) X1.3(OSC2)
PD_C: FPC2.8 R11.1 U1.81(PD11)
PD_L: FPC1.8 R12.1 U1.82(PD12)
PD_R: FPC3.8 R13.1 U1.83(PD13)
QSPI_CLK: R9.2 U2.6(CLK)
QSPI_CLK_MCU: R9.1 U1.51(PB2)
QSPI_IO0: U1.22(PF8) U2.5(DI(IO0))
QSPI_IO1: U1.23(PF9) U2.2(DO(IO1))
QSPI_IO2: U1.21(PF7) U2.3(/WP(IO2))
QSPI_IO3: U1.20(PF6) U2.7(/HOLD or /RESET(IO3))
QSPI_NCS: U1.86(PG6) U2.1(/CS)
SCLK_C: FPC2.3 R32.2
SCLK_C_MCU: R32.1 U1.44(PA5)
SCLK_L: FPC1.3 R33.2
SCLK_L_MCU: R33.1 U1.73(PB13)
SCLK_R: FPC3.3 R34.2
SCLK_R_MCU: R34.1 U1.1(PE2)
SWCLK: H2.3 U1.107(PA14)
SWDIO: H2.2 U1.102(PA13)
SWO: U1.130(PB3)
TT1: U10.1(1B)
TT1_LED_K: LED1.2(K) R25.1
TT1_OUT: R25.2 U10.18(1C)
TT2: U10.2(2B)
TT2_LED_K: LED3.2(K) R27.1
TT2_OUT: R27.2 U10.17(2C)
TT3: U10.3(3B)
TT3_LED_K: LED4.1(K) R39.1
TT3_OUT: R39.2 U10.16(3C)
TT4: U10.4(4B)
TT4_LED_K: LED2.2(K) R26.1
TT4_OUT: R26.2 U10.15(4C)
TT5: U10.5(5B)
TT5_LED_K: LED5.1(-) R40.1
TT5_OUT: R40.2 U10.14(5C)
TT6: U10.6(6B)
TT6_LED_K: LED6.1(-) R44.1
TT6_OUT: R44.2 U10.13(6C)
TT7: U10.7(7B)
TT7_LED_K: LED7.1(-) R48.1
TT7_OUT: R48.2 U10.12(7C)
TT8: U10.8(8B)
TT8_LED_K: LED8.2(-) R38.1
TT8_OUT: R38.2 U10.11(8C)
USB_CC1: U4.7(CC1) USBC1.A5(CC1)
USB_CC2: U4.6(CC2) USBC1.B5(CC2)
USB_DM: D9.4 U1.100(PA11)
USB_DM_CONN: D9.3 USBC1.A7(DN1) USBC1.B7(DN2)
USB_DP: D9.6 U1.101(PA12)
USB_DP_CONN: D9.1 USBC1.A6(DP1) USBC1.B6(DP2)
VCAP1: C3.1 U1.68(VCAP)
VCAP2: C4.1 U1.103(VCAP)
VCAP3: C5.1 U1.140(VCAP)
VCAP_BARREL: C54.1 U6.1(VCAP)
VCAP_USB: C53.1 U5.1(VCAP)

Not connected (* = marked no-connect by the designer): DC1 2; FPC1 7 9 10 11 12 13 14 15 16; FPC2 7 9 10 11 12 13 14 15 16; FPC3 7 9 10 11 12 13 14 15 16; SW1 2 3; SW2 2 3; SW3 2 3; SW4 2 3; SW6 2(B) 3(C); SW7 2(B) 3(C); U1 2(PE3) 3(PE4) 9(PC13) 10(PC14-OSC32_IN) 11(PC15-OSC32_OUT) 15(VLXSMPS)* 17(VFBSMPS)* 24(PF10) 28(PC0) 29(PC1) 30(PC2_C) 31(PC3_C) 37(PA0) 38(PA1) 39(PA2) 40(PA3) 43(PA4) 47(PC4) 48(PC5) 49(PB0) 50(PB1) 52(PF11) 53(PF14) 54(PF15) 57(PE7) 58(PE8) 59(PE9) 60(PE10) 61(PE11) 62(PE12) 63(PE13) 64(PE14) 65(PE15) 72(PB12) 84(PD14) 85(PD15) 87(PG7) 88(PG8) 93(PC6) 94(PC7) 95(PC8) 96(PC9) 97(PA8) 99(PA10) 108(PA15) 109(PC10) 110(PC11) 111(PC12) 112(PD0) 113(PD1) 114(PD2) 115(PD3) 116(PD4) 117(PD5) 120(PD6) 121(PD7) 122(PG9) 123(PG10) 124(PG11) 125(PG12) 126(PG13) 127(PG14) 131(PB4) 134(PB7) 138(PE0) 139(PE1); U4 2(CFG2)* 3(CFG3)* 4(DP)* 5(DM)* 10(PG)*; USBC1 A8(SBU1)* B8(SBU2)*

## Notes on the sheet
- CN1: CENTER panel (RVT70H 1024x600) - RiBus 20P FPC
- CN2: LEFT panel (RVT50H 800x480) - RiBus 20P FPC
- H1 telltale header - external LED + series resistor per channel (LEDs/resistors live off-board, wired to dash bezel):
  Pin1 TT1 = GREEN (left turn) - 150R | Pin2 TT2 = WHITE (headlight) - 82R | Pin3 TT3 = BLUE (high beam) - 82R | Pin4 TT4 = GREEN (right turn) - 150R
  Pin5 TT5 = ORANGE (MIL/CEL) - 180R | Pin6 TT6 = RED (parking brake) - 150R | Pin7 TT7 = RED (oil pressure) - 150R | Pin8 TT8 = YELLOW (fog lights) - 180R
  Pin9 = +5V (LED anode supply, common) | Pin10 = GND
  Wiring per LED: +5V -> series resistor (value above) -> LED anode; LED cathode -> this pin (ULN2803A sinks to GND when Teensy pin HIGH).
- CN4/CN5: Waveshare SN65HVD230 CAN breakout modules (7-pin: VCC,GND,TXD,RXD,CANH,CANL,RS). RS tied GND for auto high-speed mode. Verify pin order against physical board silkscreen.
- J3/J4: CAN termination jumpers - leave OPEN by default (vehicle bus is already terminated). Close only for bench-only bus tests.
- U10: telltale driver. H1 outputs sink to GND when ON; wire external LED anode->series resistor->+5V(H1.9), cathode->H1.1-8. Resistor/LED sized off-board per lamp color.
- CN3: RIGHT panel (RVT50H 800x480) - RiBus 20P FPC
- J1: +5V IN (dedicated 5V/15A supply)
